# Altium schematic sheet Power.SchDoc
size A; SheetNumber: 8; SheetTotal: 9
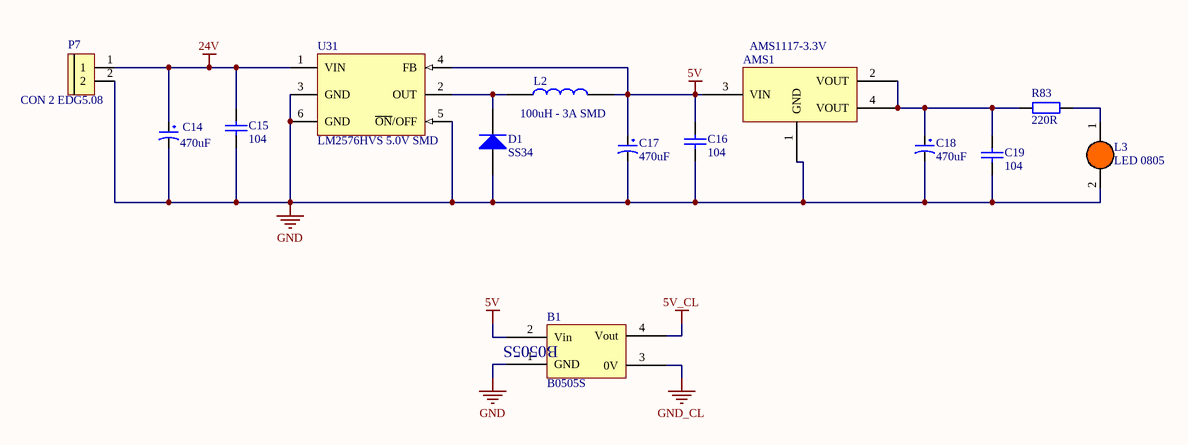
[diagram p0: Power.SchDoc]

## Parts
AMS1  AMS1117-3.3V  [SOT223]
B1  B0505S  [B0505S]
C14  470uF  [tu hoa 10mm]
C15  104  [tu 0805]
C16  104  [tu 0805]
C17  470uF  [tu hoa 8mm]
C18  470uF  [tu hoa 8mm]
C19  104  [tu 0805]
D1  SS34  [DIODE SMA]
L2  100uH - 3A SMD  [Cuon Cam 12x12x10]
L3  LED 0805  [LED-0805-Orange]
P7  CON 2 EDG5.08  [CON 2 2EDG5.08]
R83  220R  [tro smd 0805]
U31  LM2576HVS 5.0V SMD  [TO263-5]

## Nets
5V: AMS1.3(VIN) B1.2(Vin) C16.1 C17.1 L2.2 U31.4(FB)
5V_CL: B1.4(Vout)
24V: C14.1 C15.2 P7.1 U31.1(VIN)
GND: AMS1.1(GND) B1.1(GND) C14.2 C15.1 C16.2 C17.2 C18.2 C19.2 D1.1(A) L3.2(K) P7.2 U31.3(GND) U31.5(~{ON}/OFF) U31.6(GND)
GND_CL: B1.3(0V)
NetAMS1_2: AMS1.2(VOUT) AMS1.4(VOUT) C18.1 C19.1 R83.1
NetD1_2: D1.2(K) L2.1 U31.2(OUT)
NetL3_1: L3.1(A) R83.2

## Library data of the parts
AMS1 = AMS1117 SMD: Dán; Value: AMS1117-3.3V SOT223; Don_Vi: Con; Ma_Hang: MH000596; Ghi_Chu: *; Kieu_Chan: *; Chung_Loai: Dán
B1 = B0505S: Cắm; Ten_Linh_Kien: B0505S-1W SIP4 IC Converter DC-DC; Don_Vi: Con; Ma_Hang: MH003143; Ghi_Chu: *; Kieu_Chan: *; Chung_Loai: Cắm
C14 = Tu Hoa 470uF 50V 10x17: Cắm; Don_Vi: Con; So_Chan: 2; Ten_Linh_Kien: Tụ Hóa 470uF 50V; Ma_Hang: MH006866; Chung_Loai: Cắm; Kieu_Chan: *
C15 C16 C19 = Tu 0805 104 50V 10%: Dán; Don_Vi: Con; So_Chan: 2; Ten_Linh_Kien: Tụ 0805 104-100nF 10% 50V; Ma_Hang: MH004551; Chung_Loai: Dán; Kieu_Chan: *
C17 C18 = Tu Hoa 470uF 16V 8x11: Cắm; Don_Vi: Con; So_Chan: 2; Ten_Linh_Kien: Tụ Hóa 470uF 16V 8x11MM; Ma_Hang: MH006550; Chung_Loai: Cắm; Kieu_Chan: *
D1 = Diode SS34 ( 1N5822 ): Dán; Don_Vi: Con; Ma_Hang: MH002104; Ten_Linh_Kien: Diode SS34 3A 40V SMA ( 1N5822 SS34A); Kieu_Chan: *; Chung_Loai: Dán
L2 = CUON CAM 100uH SMD: Dán; Don_Vi: Con; Ma_Hang: MH003999; Ten_Linh_Kien: Cuộn Cảm 100uH 7x7x4MM CD74; Ma_Hang: *; Kieu_Chan: *; Chung_Loai: Dán
L3 = LED 0805 Cam: Dán; Don_Vi: Con; Ma_Hang: MH002328; Ten_Linh_Kien: LED 0805 Màu Cam ( Orange); Ghi_Chu: *; Kieu_Chan: *; Chung_Loai: Dán
P7 = CON 2 EDG5.08: Cắm; Ten_Linh_Kien: CON 2 2EDG5.08-2P 5.08MM ( Xanh Cong); Ma_Hang: MH000759; Ghi_Chu: *; Don_Vi: Con; Kieu_Chan: *; Chung_Loai: Cắm
R83 = Tro 0805 5% 220R: Dán; Don_Vi: Con; So_Chan: 2; Ten_Linh_Kien: Trở 0805 5% 220R; Ma_Hang: MH005259; Chung_Loai: Dán; Kieu_Chan: *
U31 = LM2576HVS 5.0V SMD: Dán; Ten_Linh_Kien: LM2576HVS-5.0V BUCK 5V 3A TO263-5; Don_Vi: Con; Ma_Hang: MH002362; Ghi_Chu: *; Kieu_Chan: *; Chung_Loai: Dán